# Altium schematic sheet Sheet1.SchDoc
size A4; SheetNumber: 1; SheetTotal: 1; SPICEModelCacheDHQMKGKX: <root> / <DocumentId>DHQMKGKX</DocumentId> / <CacheFrame Number="0"> / <Model Name="nmos" Kind="MDL"> / <Text>*Default N-Channel MOSFET / *Pinout: D,G,S / .MODEL NMOS NMOS()</Text> / </Model> / <Model Name="xtal" Kind="CKT"> / <Text>*Generic type:crystal pkg:HC33/51 / .SUBCKT XTAL 1 2 PARAMS: FREQ=1Meg RS=750 C=13pf Q=1000 / LX 1 3 {((Q*RS)/(6.2831852*FREQ))} IC=0.5M / CX 3 4 {(1/(Q*6.2831852*FREQ*RS))} / C0 1 2 {C} / RS 4 2 {RS} / .ENDS XTAL</Text> / </Model> / <Model Name="diode" Kind="MDL"> / <Text>*Default Diode / *Diode Pinout: A,K / .MODEL DIODE D()</Text> / </Model> / </CacheFrame> / </root>
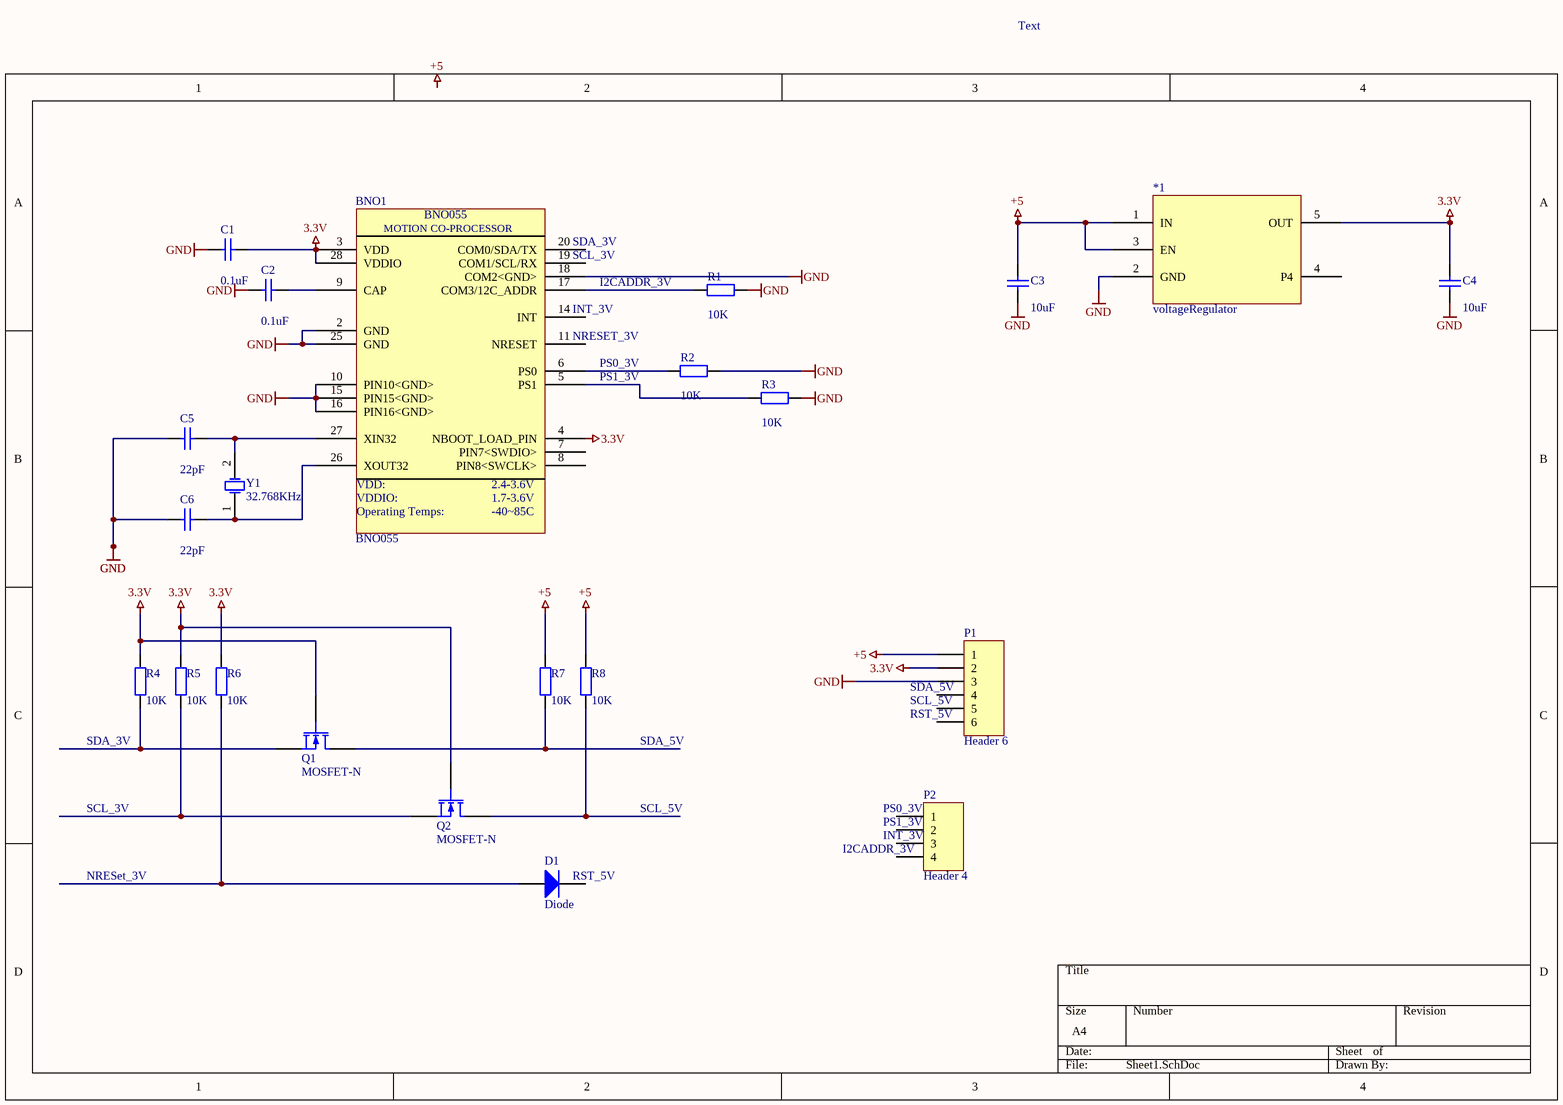
[diagram p0: Sheet1.SchDoc]

## Parts
*1  voltageRegulator  [SOT95P245X110-5N]
BNO1  BNO055  [SOIC127P980X95_HS-22N]
C1  value 0.1uF  [RAD-0.3]
C2  value 0.1uF  [RAD-0.3]
C3  value 10uF  [RAD-0.3]
C4  value 10uF  [RAD-0.3]
C5  value 22pF  [RAD-0.3]
C6  value 22pF  [RAD-0.3]
D1  Diode  [SMC]
P1  Header 6  [HDR1X6]
P2  Header 4  [HDR1X4]
Q1  MOSFET-N  [E3]
Q2  MOSFET-N  [E3]
R1  value 10K  [AXIAL-0.4]
R2  value 10K  [AXIAL-0.4]
R3  value 10K  [AXIAL-0.4]
R4  value 10K  [AXIAL-0.4]
R5  value 10K  [AXIAL-0.4]
R6  value 10K  [AXIAL-0.4]
R7  value 10K  [AXIAL-0.4]
R8  value 10K  [AXIAL-0.4]
Y1  32.768KHz  [R38]

## Nets
3.3V: *1.5(OUT) BNO1.3(VDD) BNO1.4(NBOOT_LOAD_PIN) BNO1.28(VDDIO) C1.2 C4.2 P1.2 Q1.2(G) Q2.2(G) R4.2 R5.2 R6.2
+5: *1.1(IN) *1.3(EN) C3.2 P1.1 R7.2 R8.2
GND: *1.2(GND) BNO1.2(GND) BNO1.10(PIN10<GND>) BNO1.15(PIN15<GND>) BNO1.16(PIN16<GND>) BNO1.18(COM2<GND>) BNO1.25(GND) C1.1 C2.1 C3.1 C4.1 C5.1 C6.1 P1.3 R1.1 R2.1 R3.1
NetBNO1_5: BNO1.5(PS1) R3.2
NetBNO1_6: BNO1.6(PS0) R2.2
NetBNO1_9: BNO1.9(CAP) C2.2
NetBNO1_17: BNO1.17(COM3/12C_ADDR) R1.2
NetBNO1_26: BNO1.26(XOUT32) C6.2 Y1.1(OSC1)
NetBNO1_27: BNO1.27(XIN32) C5.2 Y1.2(OSC2)
NetD1_1: D1.1(A) R6.1
NetQ1_1: Q1.1(D) R7.1
NetQ1_3: Q1.3(S) R4.1
NetQ2_1: Q2.1(D) R8.1
NetQ2_3: Q2.3(S) R5.1

Not connected (* = marked no-connect by the designer): *1 4(P4); BNO1 7(PIN7<SWDIO>) 8(PIN8<SWCLK>) 11(NRESET) 14(INT) 19(COM1/SCL/RX) 20(COM0/SDA/TX); D1 2(K); P1 4 5 6; P2 1 2 3 4

## Notes on the sheet
- Text
- (near BNO1) SDA_3V
- (near BNO1) SCL_3V
- (near BNO1) INT_3V
- I2CADDR_3V
- (near BNO1) NRESET_3V
- PS0_3V
- PS1_3V
- (near P1) SDA_5V
- (near P1) SCL_5V
- (near P1) RST_5V
- (near R4) SDA_3V
- SDA_5V
- SCL_3V
- SCL_5V
- (near P2) I2CADDR_3V
- (near P2) PS0_3V
- (near P2) PS1_3V
- (near P2) INT_3V
- NRESet_3V
- (near D1) RST_5V
- Labels drawn without touching a wire or pin: +5
- (in symbol BNO055) MOTION CO-PROCESSOR; VDD:; 2.4-3.6V; VDDIO:; 1.7-3.6V; Operating Temps:; -40~85C

## Library data of the parts
C1-C6 = Cap: Capacitor; Published: 8-Jun-2000; LatestRevisionDate: 17-Jul-2002; LatestRevisionNote: Re-released for DXP Platform.; PackageReference: RAD-0.3; Publisher: Altium Limited; PackageDescription: Radial Cap, Thru-Hole; 2 Leads; 0.3 in Pin Spacing
D1 = Diode: Default Diode; Published: 8-Jun-2000; LatestRevisionDate: 17-Jul-2002; LatestRevisionNote: Re-released for DXP Platform.; PackageVersion: Sep-1996; PackageReference: SMC; Publisher: Altium Limited; PackageDescription: DO-214-AB/SMC; 2 C-Bend Leads; Body 7.9 x 5.9 mm, inc. leads (LxW); Code_JEDEC: DO-214-AB
P1 = Header 6: Header, 6-Pin; LatestRevisionDate: 17-Jul-2002; LatestRevisionNote: Re-released for DXP Platform.; Publisher: Altium Limited
P2 = Header 4: Header, 4-Pin; LatestRevisionDate: 17-Jul-2002; LatestRevisionNote: Re-released for DXP Platform.; Publisher: Altium Limited
Q1 Q2 = MOSFET-N: N-Channel MOSFET; Published: 8-Jun-2000; LatestRevisionDate: 17-Jul-2002; LatestRevisionNote: Re-released for DXP Platform.; PackageVersion: 1995/1996; PackageReference: E3; Publisher: Altium Limited; PackageDescription: TO, Flat Index; 3 In-Line, Axial Leads; Body Dia. 4.6mm; Lead Dia. 0.5 mm (max)
R1-R8 = Res2: Resistor; Published: 8-Jun-2000; LatestRevisionDate: 17-Jul-2002; LatestRevisionNote: Re-released for DXP Platform.; PackageReference: AXIAL-0.4; Publisher: Altium Limited; PackageDescription: Axial Device, Thru-Hole; 2 Leads; 0.4 in Pin Spacing
Y1 = XTAL: Crystal Oscillator; Published: 8-Jun-2000; LatestRevisionDate: 17-Jul-2002; LatestRevisionNote: Re-released for DXP Platform.; PackageReference: R38; Publisher: Altium Limited; PackageDescription: Crystal, Thru-Hole; 2 Leads; Body 3.1 x 8.2 mm (Dia.xH)